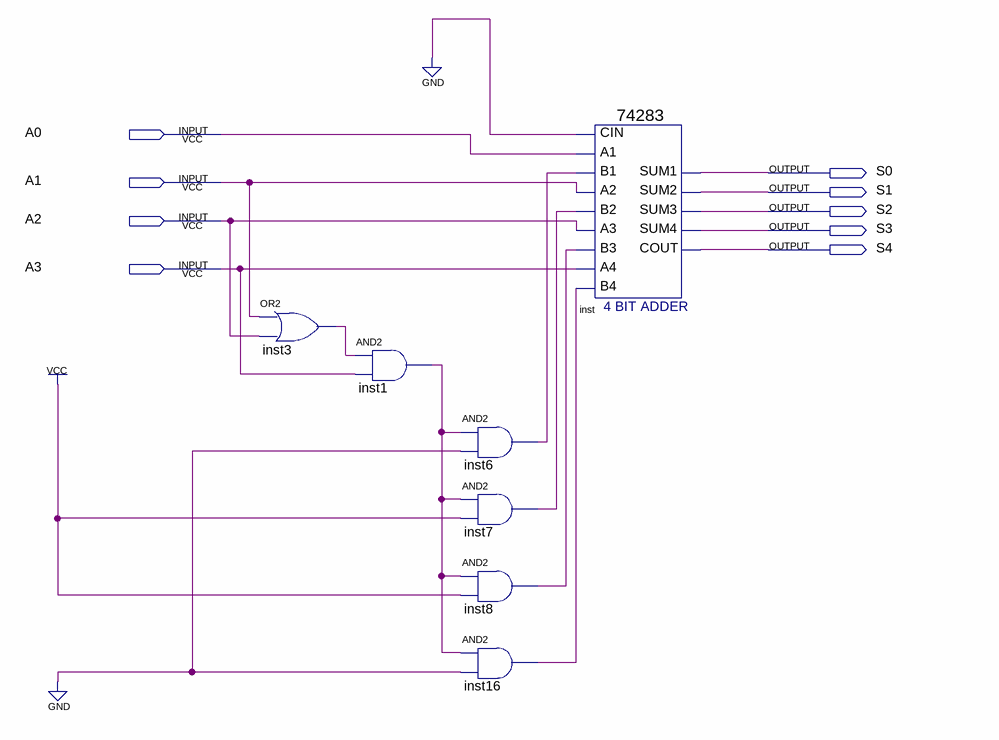
[diagram p0: schematic sheet]
// Quartus schematic btod.bdf as structural Verilog: 7 symbols, 9 pins
module btod (
  input  A0,
  input  A1,
  input  A2,
  input  A3,
  output S0,
  output S1,
  output S2,
  output S3,
  output S4
);

  wire inst1_out, inst3_out, inst6_out, inst7_out, inst8_out, inst16_out;

  or inst3 (inst3_out, A1, A2);
  and inst1 (inst1_out, inst3_out, A3);
  and inst6 (inst6_out, inst1_out, 1'b0);
  and inst7 (inst7_out, inst1_out, 1'b1);
  and inst8 (inst8_out, inst1_out, 1'b1);
  and inst16 (inst16_out, inst1_out, 1'b0);
  \74283  inst (
    .CIN(1'b0), .A1(A0), .A2(A1), .B2(inst7_out), .A3(A2), .A4(A3), .B4(inst16_out), .B1(inst6_out),
    .B3(inst8_out), .SUM4(S3), .COUT(S4), .SUM1(S0), .SUM2(S1), .SUM3(S2));
endmodule
